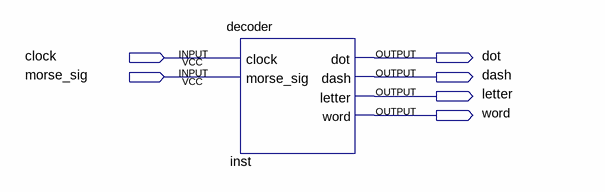
[diagram p0: schematic sheet]
// Quartus schematic morsedecode.bdf as structural Verilog: 1 symbols, 6 pins
module morsedecode (
  input  clock,
  input  morse_sig,
  output dot,
  output dash,
  output letter,
  output word
);

  decoder inst (.clock(clock), .morse_sig(morse_sig), .dot(dot), .dash(dash), .letter(letter), .word(word));
endmodule
